# Altium schematic sheet Power.SchDoc
size A4
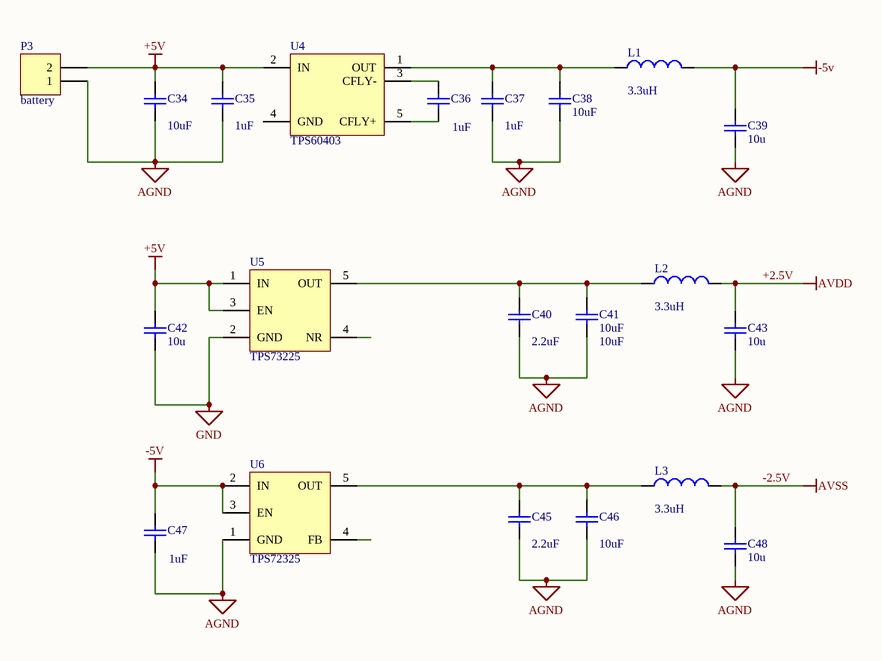
[diagram p0: Power.SchDoc]

## Parts
C34  value 10uF  [RAD-0.3]
C35  value 1uF  [RAD-0.3]
C36  value 1uF  [RAD-0.3]
C37  value 1uF  [RAD-0.3]
C38  10uF  [RAD-0.3]
C39  10u  [RAD-0.3]
C40  value 2.2uF  [RAD-0.3]
C41  10uF  [RAD-0.3]
C42  10u  [RAD-0.3]
C43  10u  [RAD-0.3]
C45  value 2.2uF  [RAD-0.3]  (hidden comment: Cap)
C46  value 10uF  [RAD-0.3]  (hidden comment: Cap)
C47  value 1uF  [RAD-0.3]
C48  10u  [RAD-0.3]
L1  value 3.3uH  [0402-A]
L2  value 3.3uH  [0402-A]
L3  value 3.3uH  [0402-A]  (hidden comment: Inductor)
P3  battery  [HDR1X2]
U4  TPS60403
U5  TPS73225
U6  TPS72325

## Nets
+2.5V: C43.2 L2.2  [also labelled AVDD]
+5V: C34.2 C35.2 C42.2 P3.2 U4.2(IN) U5.1(IN) U5.3(EN)
-2.5V: C48.2 L3.2  [also labelled AVSS]
-5V: C39.2 C47.2 L1.2 U6.2(IN) U6.3(EN)
AGND: C34.1 C35.1 C37.1 C38.1 C39.1 C40.1 C41.1 C43.1 C45.1 C46.1 C47.1 C48.1 P3.1 U6.1(GND)
GND: C42.1 U5.2(GND)
NetC36_1: C36.1 U4.5(CFLY+)
NetC36_2: C36.2 U4.3(CFLY-)
NetC37_2: C37.2 C38.2 L1.1 U4.1(OUT)
NetC40_2: C40.2 C41.2 L2.1 U5.5(OUT)
NetC45_2: C45.2 C46.2 L3.1 U6.5(OUT)

Not connected (* = marked no-connect by the designer): U4 4(GND); U5 4(NR); U6 4(FB)

## Library data of the parts
C34-C43 C45-C48 = Cap: Capacitor
  C35 C37 C40 C45 C46: Published: 8-Jun-2000; LatestRevisionDate: 17-Jul-2002; LatestRevisionNote: Re-released for DXP Platform.; PackageReference: RAD-0.3; Publisher: Altium Limited; PackageDescription: Radial Cap, Thru-Hole; 2 Leads; 0.3 in Pin Spacing
  C38: Published: 8-Jun-2000; LatestRevisionDate: 17-Jul-2002; LatestRevisionNote: Re-released for DXP Platform.; PackageReference: RAD-0.3; Publisher: Altium Limited; PackageDescription: Radial Cap, Thru-Hole; 2 Leads; 0.3 in Pin Spacing; Value: 10uF
  C39 C42 C43 C48: LatestRevisionNote: Re-released for DXP Platform.; Publisher: Altium Limited
  C41: LatestRevisionNote: Re-released for DXP Platform.; PackageReference: RAD-0.3; PackageDescription: Radial Cap, Thru-Hole; 2 Leads; 0.3 in Pin Spacing; Value: 10uF; Parameter 1: *
  C47: Publisher: Altium Limited
L1 L2 = Inductor: Code_IEC: 1005; Published: 8-Jun-2000; LatestRevisionDate: 29-May-2009; LatestRevisionNote: IPC-7351 Footprint Added.; PackageReference: 0402-A; Publisher: Altium Limited; PackageDescription: Chip Inductor; Code_JEITA: 0402
P3 = Header 2: Header, 2-Pin; Publisher: Altium Limited
L3 = Inductor: Publisher: Altium Limited
U4 = TPS60403: ComponentLink1Description: link; ComponentLink1URL: https://www.digikey.ca/product-detail/en/texas-instruments/TPS60403DBVR/296-27005-1-ND/2255295; digikey part number: https://www.digikey.ca/product-detail/en/texas-instruments/TPS60403DBVR/296-27005-1-ND/2255295; Parameter 1: *
U5 = TPS73225: digikey part number: 296-15810-1-ND; ComponentLink1Description: link; ComponentLink1URL: https://www.digikey.ca/product-detail/en/texas-instruments/TPS73225DBVT/296-15810-1-ND/604364
U6 = TPS72325: digikey part number: 296-39479-1-ND; ComponentLink1Description: link; ComponentLink1URL: https://www.digikey.ca/product-detail/en/texas-instruments/TPS72325DBVR/296-39479-1-ND/5143427